# EAGLE design MAX_DRIVER (EAGLE 8.0.1)
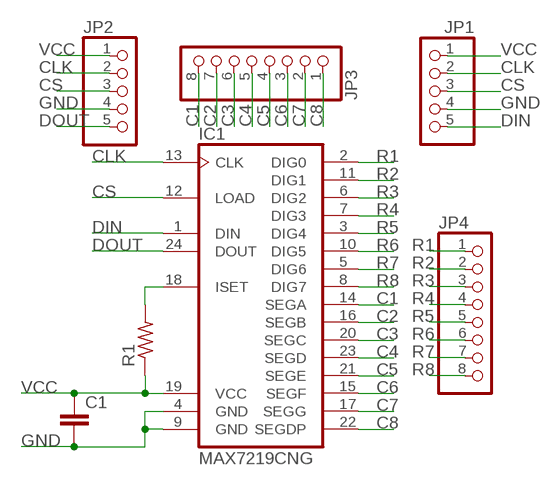
[diagram p0: schematic, sheet 1]

## Parts
C1  C-EU025-025X050  [C025-025X050]
IC1  MAX7219CNG  [DIL24-3]
JP1  PINHD-1X5  [1X05]
JP2  PINHD-1X5  [1X05]
JP3  PINHD-1X8  [1X08]
JP4  PINHD-1X8  [1X08]
R1  R-US_M1206  [M1206]

## Nets
C1: IC1.14(SEGA) JP3.8
C2: IC1.16(SEGB) JP3.7
C3: IC1.20(SEGC) JP3.6
C4: IC1.23(SEGD) JP3.5
C5: IC1.21(SEGE) JP3.4
C6: IC1.15(SEGF) JP3.3
C7: IC1.17(SEGG) JP3.2
C8: IC1.22(SEGDP) JP3.1
CLK: IC1.13(CLK) JP1.2 JP2.2
CS: IC1.12(LOAD) JP1.3 JP2.3
DIN: IC1.1(DIN) JP1.5
DOUT: IC1.24(DOUT) JP2.5
GND: C1.2 IC1.4(GND) IC1.9(GND) JP1.4 JP2.4
N$1: IC1.18(ISET) R1.2
R1: IC1.2(DIG0) JP4.1
R2: IC1.11(DIG1) JP4.2
R3: IC1.6(DIG2) JP4.3
R4: IC1.7(DIG3) JP4.4
R5: IC1.3(DIG4) JP4.5
R6: IC1.10(DIG5) JP4.6
R7: IC1.5(DIG6) JP4.7
R8: IC1.8(DIG7) JP4.8
VCC: C1.1 IC1.19(VCC) JP1.1 JP2.1 R1.1

## Library data of the parts
C1 = rcl:C-EU: CAPACITOR, European symbol
IC1 = maxim:MAX7219CNG: LED DISPLAY DRIVER; MF: MAXIM; MPN: MAX7219CNG; OC_FARNELL: 1523914; OC_NEWARK: 34C4018
JP1 JP2 = pinhead:PINHD-1X5: PIN HEADER
JP3 JP4 = pinhead:PINHD-1X8: PIN HEADER
R1 = rcl:R-US_: RESISTOR, American symbol

## Board
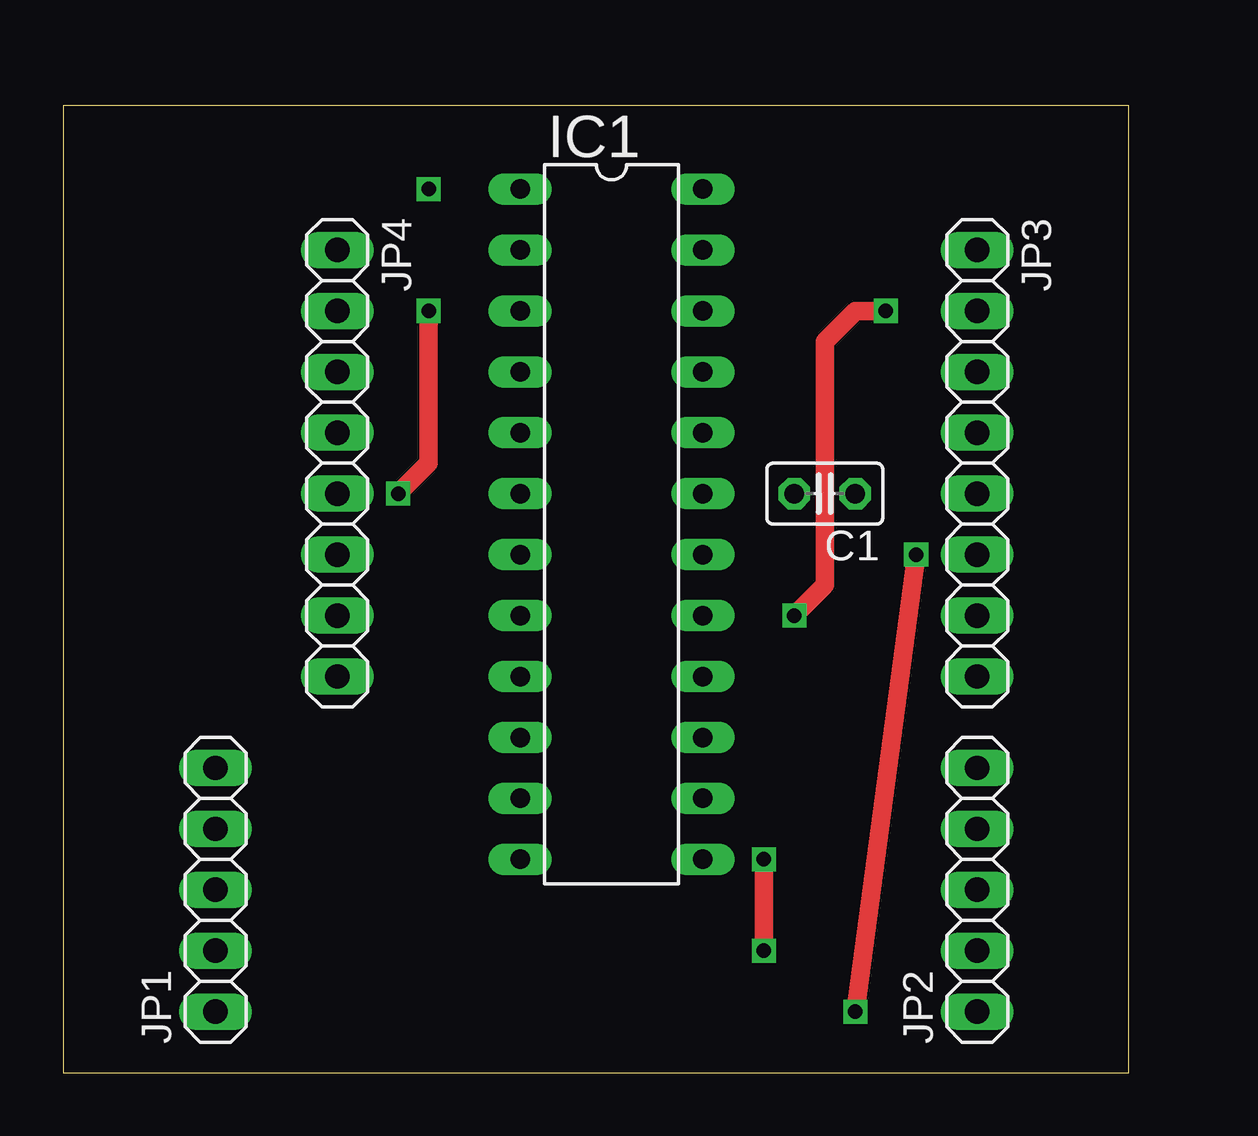
[diagram p1: board, top side]
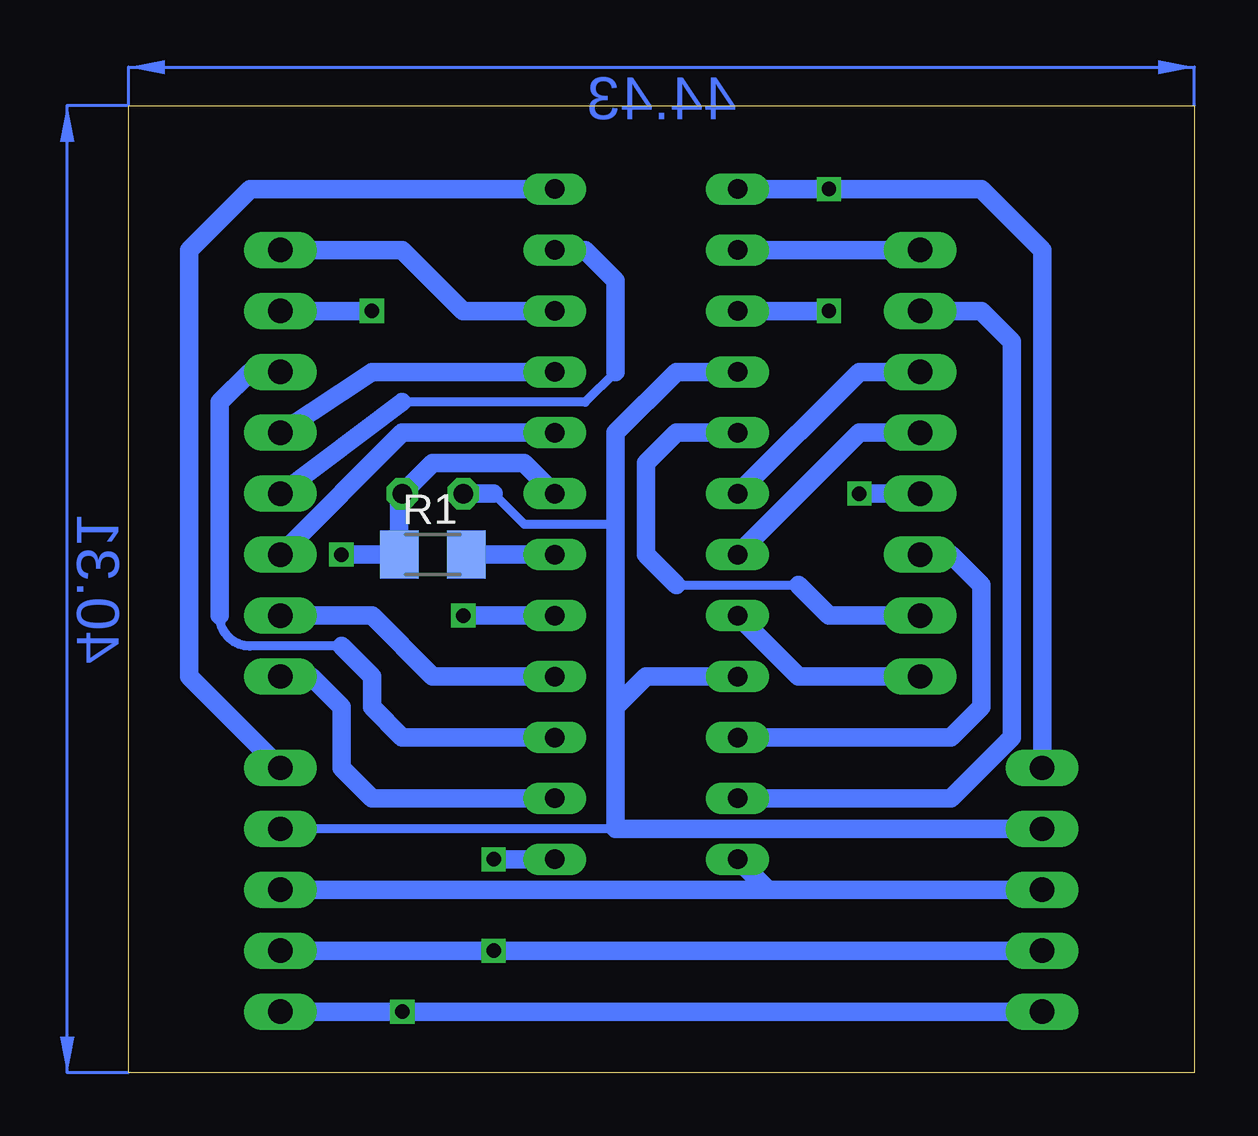
[diagram p2: board, bottom side, seen from below]

Size 44.43 x 40.31 mm. Coordinates in mm from the lower left corner, seen from the top.
Outline: 0,0 44.43,0 44.43,40.31 0,40.31 0,0
Copper layers (1*16): Top 0.035mm / dielectric 1.5mm / Bottom 0.035mm
Design rules "default": minimum track width 10mil, minimum drill 24mil, track to track 8mil, track to pad 8mil, pad to pad 8mil, via to via 8mil, smd to smd 8mil, copper to edge 40mil, drill to drill 8mil, minimum pad ring 10mil, minimum via ring 8mil, stop-mask expansion 4mil, vias tented up to drill 0mil, thermal gap 10mil

### Footprints (pad centres in the part's own frame; a part is rotated, then mirrored left to right if it is on the bottom)
C025-025X050 = drill 0.813 octagon: 1 -1.27,0; 2 1.27,0
DIL24-3 = drill 0.813 long: 1 -13.97,-3.81; 2 -11.43,-3.81; 3 -8.89,-3.81; 4 -6.35,-3.81; 5 -3.81,-3.81; 6 -1.27,-3.81; 7 1.27,-3.81; 8 3.81,-3.81; 9 6.35,-3.81; 10 8.89,-3.81; 11 11.43,-3.81; 12 13.97,-3.81; 13 13.97,3.81; 14 11.43,3.81; 15 8.89,3.81; 16 6.35,3.81; 17 3.81,3.81; 18 1.27,3.81; 19 -1.27,3.81; 20 -3.81,3.81; 21 -6.35,3.81; 22 -8.89,3.81; 23 -11.43,3.81; 24 -13.97,3.81
1X05 = drill 1.016 long: 1 -5.08,0; 2 -2.54,0; 3 0,0; 4 2.54,0; 5 5.08,0
1X08 = drill 1.016 long: 1 -8.89,0; 2 -6.35,0; 3 -3.81,0; 4 -1.27,0; 5 1.27,0; 6 3.81,0; 7 6.35,0; 8 8.89,0
M1206 = smd 1.6 x 2: 1 -1.4,0; 2 1.4,0

### Placement (x,y rotation side)
C1  31.75,24.13 180 top
IC1  22.86,22.86 270 top
JP1  6.35,7.62 90 top
JP2  38.1,7.62 90 top
JP3  38.1,25.4 270 top
JP4  11.43,25.4 270 top
R1  31.75,21.59 0 bottom

### Tracks (layer width: path | path; a pad name or v marks a point on that pad's centre or on a via)
C1
  Bottom 0.762: IC1.14 34.29,11.43 35.56,12.7 35.56,15.24 36.83,16.51 JP3.8
C2
  Bottom 0.762: IC1.16 31.75,16.51 34.29,19.05 JP3.7
C3
  Bottom 0.762: IC1.20 33.02,26.67 JP3.6
C4
  Bottom 0.381: 24.13,29.21 25.4,27.94 33.02,27.94
  Bottom 0.762: 24.13,29.21 24.13,33.02 25.4,34.29 IC1.23 | 33.02,27.94 JP3.5
C5
  Bottom 0.762: IC1.21 34.29,29.21 JP3.4
C6
  Bottom 0.381: 35.56,17.78 39.37,17.78 arc90 40.64,19.05
  Bottom 0.762: IC1.15 33.02,13.97 34.29,15.24 34.29,16.51 35.56,17.78 | 40.64,19.05 40.64,27.94 39.37,29.21 JP3.3
C7  (via drill 0.6)
  Top 0.762: v30.48,19.05 31.75,20.32 31.75,30.48 33.02,31.75 v34.29,31.75
  Bottom 0.762: IC1.17 v30.48,19.05 | JP3.2 v34.29,31.75
C8
  Bottom 0.762: IC1.22 30.48,31.75 33.02,34.29 JP3.1
CLK  (via drill 0.6)
  Top 0.762: v29.21,8.89 v29.21,5.08
  Bottom 0.762: JP2.2 v29.21,5.08 JP1.2 | IC1.13 v29.21,8.89
CS
  Bottom 0.762: 17.78,7.62 JP1.3 | 17.78,7.62 JP2.3 | IC1.12 17.78,7.62
DIN  (via drill 0.6)
  Bottom 0.762: JP1.5 6.35,34.29 8.89,36.83 v15.24,36.83 IC1.1
DOUT
  Bottom 0.762: IC1.24 39.37,36.83 41.91,34.29 41.91,16.51 JP2.5
GND
  Bottom 0.381: 24.13,10.16 JP2.4 | 29.21,24.13 27.94,22.86 24.13,22.86
  Bottom 0.762: JP1.4 24.13,10.16 24.13,15.24 | IC1.9 22.86,16.51 24.13,15.24 | 24.13,15.24 24.13,22.86 24.13,26.67 21.59,29.21 IC1.4 | C1.2 29.21,24.13
N$1
  Bottom 0.762: IC1.18 R1.2
R1
  Bottom 0.762: IC1.2 JP4.1
R2
  Bottom 0.762: IC1.11 10.16,11.43 7.62,13.97 7.62,30.48 8.89,31.75 JP4.2
R3
  Bottom 0.762: JP4.3 13.97,29.21 IC1.6
R4
  Bottom 0.762: JP4.4 13.97,26.67 IC1.7
R5  (via drill 0.6)
  Top 0.762: v13.97,24.13 15.24,25.4 v15.24,31.75
  Bottom 0.762: v15.24,31.75 IC1.3 | JP4.5 v13.97,24.13
R6
  Bottom 0.762: JP4.6 10.16,21.59 8.89,20.32 8.89,15.24 10.16,13.97 IC1.10
R7
  Bottom 0.381: 21.59,20.32 16.51,20.32
  Bottom 0.762: 16.51,20.32 15.24,19.05 JP4.7 | 21.59,20.32 22.86,21.59 22.86,25.4 21.59,26.67 IC1.5
R8
  Bottom 0.762: IC1.8 16.51,16.51 JP4.8
VCC  (via drill 0.6)
  Top 0.762: v35.56,21.59 v33.02,2.54
  Bottom 0.762: JP1.1 v33.02,2.54 JP2.1 | IC1.19 27.94,25.4 31.75,25.4 C1.1 33.15,24 R1.1 v35.56,21.59
(copper drawn outside any net)
  shapes: Bottom area x2